# EAGLE schematic schematics (EAGLE 6.6.0)
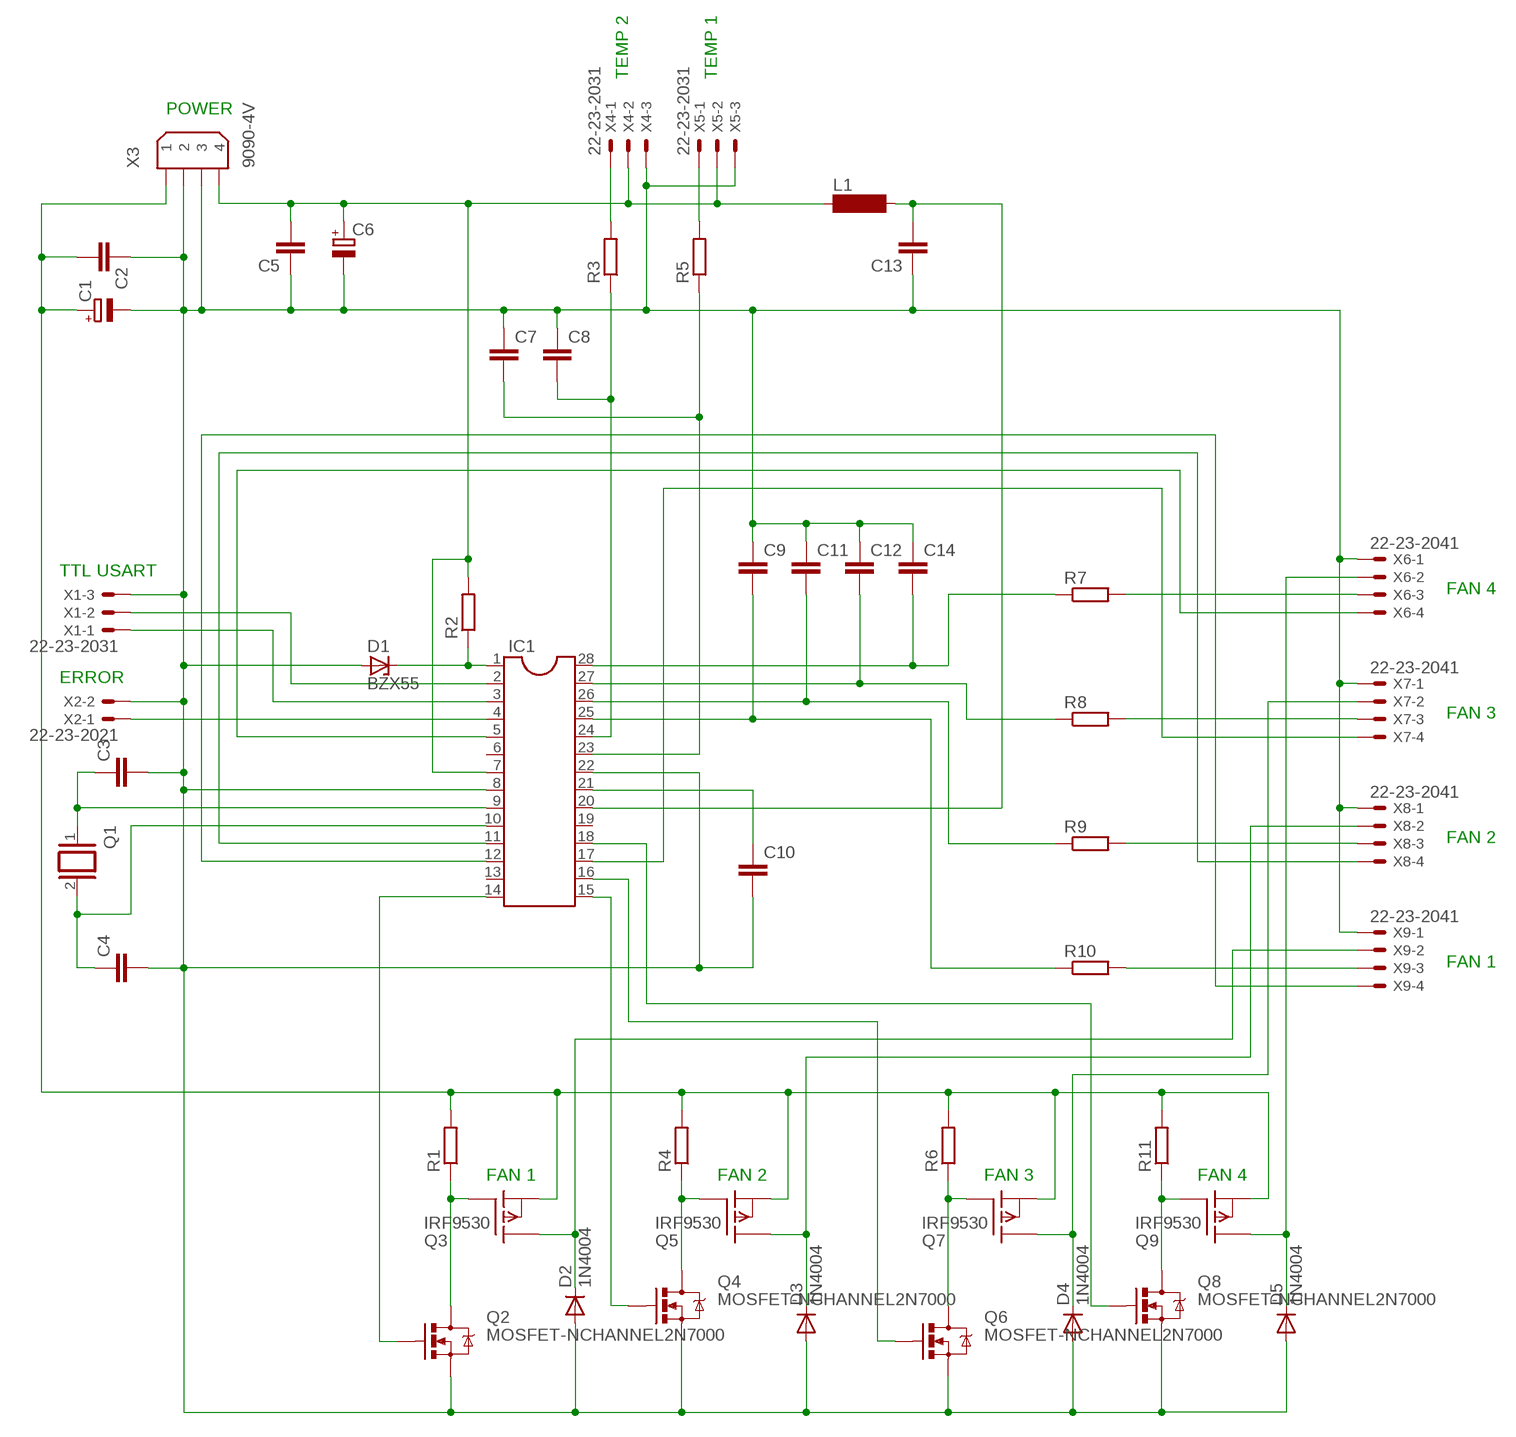
[diagram p0: schematic, sheet 1]

## Parts
C1  CPOL-EUE5-8.5  [E5-8,5]
C2  C-EU050-025X075  [C050-025X075]
C3  C-EU050-025X075  [C050-025X075]
C4  C-EU050-025X075  [C050-025X075]
C5  C-EU050-025X075  [C050-025X075]
C6  CPOL-EUE5-8.5  [E5-8,5]
C7  C-EU050-025X075  [C050-025X075]
C8  C-EU050-025X075  [C050-025X075]
C9  C-EU050-025X075  [C050-025X075]
C10  C-EU050-025X075  [C050-025X075]
C11  C-EU050-025X075  [C050-025X075]
C12  C-EU050-025X075  [C050-025X075]
C13  C-EU050-025X075  [C050-025X075]
C14  C-EU050-025X075  [C050-025X075]
D1  BZX55  [DO35Z10]
D2  1N4004  [DO41-10]
D3  1N4004  [DO41-10]
D4  1N4004  [DO41-10]
D5  1N4004  [DO41-10]
IC1  DIL28-3  [DIL28-3]
L1  SD12K100  [SD12K100]
Q1  XTAL  [Q]
Q2  MOSFET-NCHANNEL2N7000  [TO-92]
Q3  IRF9530  [TO220]
Q4  MOSFET-NCHANNEL2N7000  [TO-92]
Q5  IRF9530  [TO220]
Q6  MOSFET-NCHANNEL2N7000  [TO-92]
Q7  IRF9530  [TO220]
Q8  MOSFET-NCHANNEL2N7000  [TO-92]
Q9  IRF9530  [TO220]
R1  R-EU_0207/10  [0207/10]
R2  R-EU_0207/10  [0207/10]
R3  R-EU_0207/10  [0207/10]
R4  R-EU_0207/10  [0207/10]
R5  R-EU_0207/10  [0207/10]
R6  R-EU_0207/10  [0207/10]
R7  R-EU_0207/10  [0207/10]
R8  R-EU_0207/10  [0207/10]
R9  R-EU_0207/10  [0207/10]
R10  R-EU_0207/10  [0207/10]
R11  R-EU_0207/10  [0207/10]
X1  22-23-2031  [22-23-2031]
X2  22-23-2021  [22-23-2021]
X3  9090-4V  [9090-4V]
X4  22-23-2031  [22-23-2031]
X5  22-23-2031  [22-23-2031]
X6  22-23-2041  [22-23-2041]
X7  22-23-2041  [22-23-2041]
X8  22-23-2041  [22-23-2041]
X9  22-23-2041  [22-23-2041]

## Nets
N$1: D1.C IC1.1 R2.1
N$2: C5.2 C6.+ IC1.7 L1.1 R2.2 X3.4 X4.2 X5.2
N$3: C14.2 IC1.28 R7.1
N$4: C12.2 IC1.27 R8.1
N$5: C11.2 IC1.26 R9.1
N$6: C9.2 IC1.25 R10.1
N$7: C1.- C2.1 C3.2 C4.2 C5.1 C6.- C7.1 C8.1 C9.1 C10.2 C11.1 C12.1 C13.1 C14.1 D1.A D2.A D3.A D4.A D5.A IC1.8 IC1.22 Q2.1(S) Q4.1(S) Q6.1(S) Q8.1(S) X1.3 X2.2 X3.2 X3.3 X4.3 X5.3 X6.1 X7.1 X8.1 X9.1
N$9: Q2.3(D) Q3.1(G) R1.1
N$10: Q4.3(D) Q5.1(G) R4.1
N$11: Q6.3(D) Q7.1(G) R6.1
N$12: Q8.3(D) Q9.1(G) R11.1
N$13: C1.+ C2.2 Q3.3(S) Q5.3(S) Q7.3(S) Q9.3(S) R1.2 R4.2 R6.2 R11.2 X3.1
N$14: IC1.14 Q2.2(G)
N$15: IC1.15 Q4.2(G)
N$16: IC1.16 Q6.2(G)
N$17: IC1.18 Q8.2(G)
N$18: R7.2 X6.3
N$19: R8.2 X7.3
N$20: R9.2 X8.3
N$21: IC1.4 X2.1
N$22: R10.2 X9.3
N$23: IC1.5 X6.4
N$24: IC1.12 X9.4
N$25: IC1.11 X8.4
N$26: IC1.17 X7.4
N$27: C10.1
N$28: D3.C Q5.2(D) X8.2
N$29: C7.2 IC1.23 R5.1
N$30: C8.2 IC1.24 R3.1
N$31: D2.C Q3.2(D) X9.2
N$32: D4.C Q7.2(D) X7.2
N$33: D5.C Q9.2(D) X6.2
N$34: R3.2 X4.1
N$35: R5.2 X5.1
N$36: C3.1 IC1.9 Q1.1
N$37: C4.1 IC1.10 Q1.2
N$39: IC1.3 X1.1
N$40: IC1.2 X1.2
N$41: C13.2 IC1.20 L1.2
Unconnected: IC1.6 IC1.13 IC1.19 IC1.21

## Notes on the sheet
- TEMP 2 | TEMP 1
- POWER
- TTL USART
- FAN 4
- ERROR
- FAN 3
- FAN 2
- FAN 1
- FAN 1 | FAN 2 | FAN 3 | FAN 4

## Library data of the parts
C1 C6 = rcl:CPOL-EU: POLARIZED CAPACITOR, European symbol
C2-C5 C7-C14 = rcl:C-EU: CAPACITOR, European symbol
D1 = diode:BZX55: Z DIODE
D2-D5 = diode:1N4004: DIODE general purpose rectifier, 1 A
IC1 = ic-package:DIL28: Dual In Line
L1 = inductor-neosid:SD12: INDUCTOR nominal inductance; OC_FARNELL: unknown; OC_NEWARK: unknown
Q1 = special:XTAL: CRYSTAL
Q2 Q4 Q6 Q8 = sparkfun-discretesemi:MOSFET-NCHANNEL: Common NMOSFET Parts MFG P/N Store ID Prod ID FDD8780 TRANS-09984 SI7820DN TRANS-11055 FDS6630A IC-08089 2N7002PW TRANS-11151 FQP30N06L COM-10213 TRANS-10060 BSS123LT1G TRANS-08345 BSS138 TRANS-00830 BS170 2N7000
Q3 Q5 Q7 Q9 = transistor-fet:IRF9530: P-Channel Enhancement MOSFET (HEXFET); -100V; -12A; 0,3Ohm
R1-R11 = rcl:R-EU_: RESISTOR, European symbol
X1 X4 X5 = con-molex:22-23-2031: .100" (2.54mm) Center Header - 3 Pin; MF: MOLEX; MPN: 22-23-2031; OC_FARNELL: 1462950; OC_NEWARK: 30C0862
X2 = con-molex:22-23-2021: .100" (2.54mm) Center Header - 2 Pin; MF: MOLEX; MPN: 22-23-2021; OC_FARNELL: 1462926; OC_NEWARK: 25C3832
X3 = con-thomas-betts:9090-4: Disk Drive Power four position Source: Thomas & Betts Electronic Interconnects Eiropean Edition 1998; OC_FARNELL: unknown; OC_NEWARK: unknown
X6-X9 = con-molex:22-23-2041: .100" (2.54mm) Center Header - 4 Pin; MF: MOLEX; MPN: 22-23-2041; OC_FARNELL: 1462920; OC_NEWARK: 38C0355